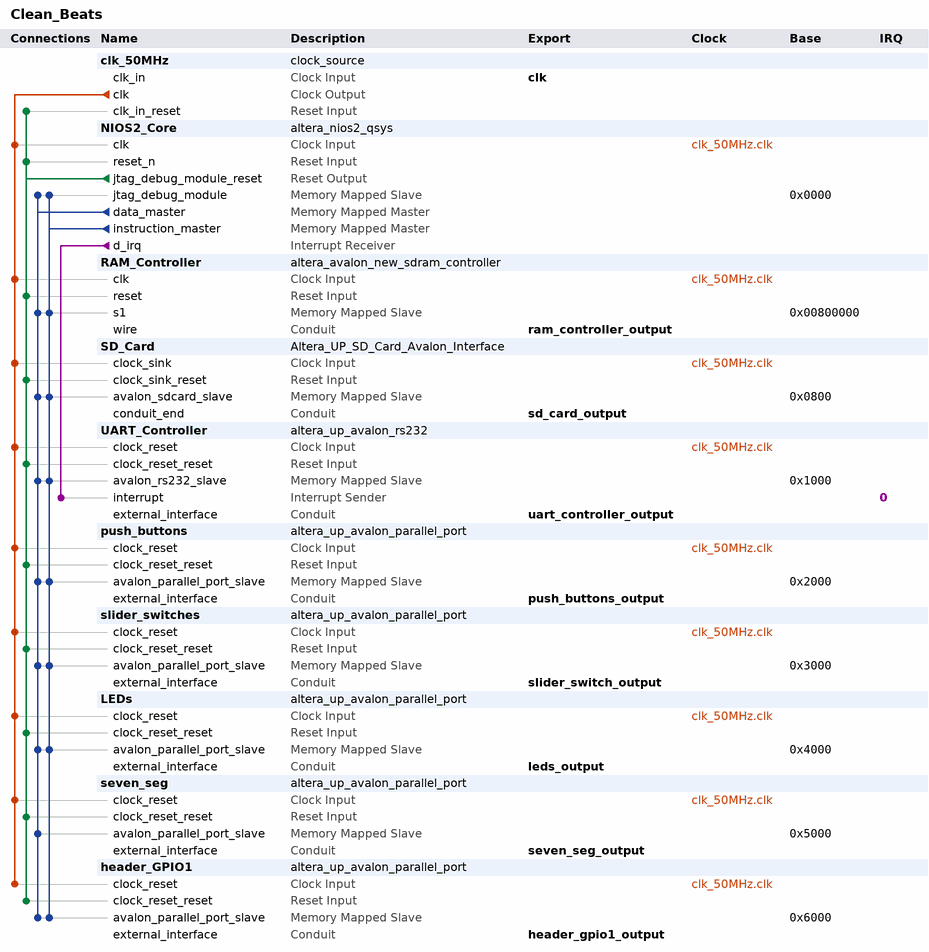
[diagram p0: system contents]
# Platform Designer (Qsys) system Clean_Beats, Cyclone III EP3C16F484C6
# Parameters at their usual value, and those the tool derives, are not listed.
package require -exact qsys 12.0
create_system Clean_Beats
set_project_property DEVICE_FAMILY {Cyclone III}
set_project_property DEVICE EP3C16F484C6

add_instance clk_50MHz clock_source 12.1
set_instance_parameter_value clk_50MHz clockFrequency 50000000

add_instance NIOS2_Core altera_nios2_qsys 12.1
set_instance_parameter_value NIOS2_Core resetSlave RAM_Controller.s1
set_instance_parameter_value NIOS2_Core exceptionSlave RAM_Controller.s1
set_instance_parameter_value NIOS2_Core breakSlave NIOS2_Core.jtag_debug_module
set_instance_parameter_value NIOS2_Core impl Fast
set_instance_parameter_value NIOS2_Core icache_size 4096
set_instance_parameter_value NIOS2_Core debug_level Level2

add_instance RAM_Controller altera_avalon_new_sdram_controller 12.1
set_instance_parameter_value RAM_Controller TAC 5.5
set_instance_parameter_value RAM_Controller TRCD 20.0
set_instance_parameter_value RAM_Controller TRP 20.0
set_instance_parameter_value RAM_Controller casLatency 3
set_instance_parameter_value RAM_Controller columnWidth 8
set_instance_parameter_value RAM_Controller dataWidth 16
set_instance_parameter_value RAM_Controller generateSimulationModel false
set_instance_parameter_value RAM_Controller model custom
set_instance_parameter_value RAM_Controller numberOfBanks 4
set_instance_parameter_value RAM_Controller numberOfChipSelects 1
set_instance_parameter_value RAM_Controller powerUpDelay 100.0
set_instance_parameter_value RAM_Controller refreshPeriod 15.625
set_instance_parameter_value RAM_Controller rowWidth 12

add_instance SD_Card Altera_UP_SD_Card_Avalon_Interface 1.0

add_instance UART_Controller altera_up_avalon_rs232 12.0
set_instance_parameter_value UART_Controller baud 115200
set_instance_parameter_value UART_Controller parity None

add_instance push_buttons altera_up_avalon_parallel_port 12.0
set_instance_parameter_value push_buttons board DE0
set_instance_parameter_value push_buttons preset Pushbuttons
set_instance_parameter_value push_buttons capture false
set_instance_parameter_value push_buttons edge Rising
set_instance_parameter_value push_buttons irq false

add_instance slider_switches altera_up_avalon_parallel_port 12.0
set_instance_parameter_value slider_switches board DE0
set_instance_parameter_value slider_switches preset {Slider Switches}
set_instance_parameter_value slider_switches capture false
set_instance_parameter_value slider_switches edge Rising
set_instance_parameter_value slider_switches irq false

add_instance LEDs altera_up_avalon_parallel_port 12.0
set_instance_parameter_value LEDs board DE0
set_instance_parameter_value LEDs preset LEDs
set_instance_parameter_value LEDs capture false
set_instance_parameter_value LEDs edge Rising
set_instance_parameter_value LEDs irq false

add_instance seven_seg altera_up_avalon_parallel_port 12.0
set_instance_parameter_value seven_seg board DE0
set_instance_parameter_value seven_seg preset {Seven Segment Displays}
set_instance_parameter_value seven_seg capture false
set_instance_parameter_value seven_seg edge Rising
set_instance_parameter_value seven_seg irq false

add_instance header_GPIO1 altera_up_avalon_parallel_port 12.0
set_instance_parameter_value header_GPIO1 board DE0
set_instance_parameter_value header_GPIO1 preset {Expansion Header}
set_instance_parameter_value header_GPIO1 gpio {GPIO 1 (JP2)}
set_instance_parameter_value header_GPIO1 capture false
set_instance_parameter_value header_GPIO1 edge Rising
set_instance_parameter_value header_GPIO1 irq false

# connections
add_connection clk_50MHz.clk header_GPIO1.clock_reset clock
add_connection clk_50MHz.clk LEDs.clock_reset clock
add_connection clk_50MHz.clk NIOS2_Core.clk clock
add_connection clk_50MHz.clk push_buttons.clock_reset clock
add_connection clk_50MHz.clk RAM_Controller.clk clock
add_connection clk_50MHz.clk SD_Card.clock_sink clock
add_connection clk_50MHz.clk seven_seg.clock_reset clock
add_connection clk_50MHz.clk slider_switches.clock_reset clock
add_connection clk_50MHz.clk UART_Controller.clock_reset clock
add_connection NIOS2_Core.jtag_debug_module_reset clk_50MHz.clk_in_reset reset
add_connection NIOS2_Core.jtag_debug_module_reset header_GPIO1.clock_reset_reset reset
add_connection NIOS2_Core.jtag_debug_module_reset LEDs.clock_reset_reset reset
add_connection NIOS2_Core.jtag_debug_module_reset NIOS2_Core.reset_n reset
add_connection NIOS2_Core.jtag_debug_module_reset push_buttons.clock_reset_reset reset
add_connection NIOS2_Core.jtag_debug_module_reset RAM_Controller.reset reset
add_connection NIOS2_Core.jtag_debug_module_reset SD_Card.clock_sink_reset reset
add_connection NIOS2_Core.jtag_debug_module_reset seven_seg.clock_reset_reset reset
add_connection NIOS2_Core.jtag_debug_module_reset slider_switches.clock_reset_reset reset
add_connection NIOS2_Core.jtag_debug_module_reset UART_Controller.clock_reset_reset reset
add_connection NIOS2_Core.data_master header_GPIO1.avalon_parallel_port_slave avalon
set_connection_parameter_value NIOS2_Core.data_master/header_GPIO1.avalon_parallel_port_slave baseAddress 0x6000
add_connection NIOS2_Core.data_master LEDs.avalon_parallel_port_slave avalon
set_connection_parameter_value NIOS2_Core.data_master/LEDs.avalon_parallel_port_slave baseAddress 0x4000
add_connection NIOS2_Core.data_master NIOS2_Core.jtag_debug_module avalon
set_connection_parameter_value NIOS2_Core.data_master/NIOS2_Core.jtag_debug_module baseAddress 0x0000
add_connection NIOS2_Core.data_master push_buttons.avalon_parallel_port_slave avalon
set_connection_parameter_value NIOS2_Core.data_master/push_buttons.avalon_parallel_port_slave baseAddress 0x2000
add_connection NIOS2_Core.data_master RAM_Controller.s1 avalon
set_connection_parameter_value NIOS2_Core.data_master/RAM_Controller.s1 baseAddress 0x00800000
add_connection NIOS2_Core.data_master SD_Card.avalon_sdcard_slave avalon
set_connection_parameter_value NIOS2_Core.data_master/SD_Card.avalon_sdcard_slave baseAddress 0x0800
add_connection NIOS2_Core.data_master seven_seg.avalon_parallel_port_slave avalon
set_connection_parameter_value NIOS2_Core.data_master/seven_seg.avalon_parallel_port_slave baseAddress 0x5000
add_connection NIOS2_Core.data_master slider_switches.avalon_parallel_port_slave avalon
set_connection_parameter_value NIOS2_Core.data_master/slider_switches.avalon_parallel_port_slave baseAddress 0x3000
add_connection NIOS2_Core.data_master UART_Controller.avalon_rs232_slave avalon
set_connection_parameter_value NIOS2_Core.data_master/UART_Controller.avalon_rs232_slave baseAddress 0x1000
add_connection NIOS2_Core.instruction_master header_GPIO1.avalon_parallel_port_slave avalon
set_connection_parameter_value NIOS2_Core.instruction_master/header_GPIO1.avalon_parallel_port_slave baseAddress 0x6000
add_connection NIOS2_Core.instruction_master LEDs.avalon_parallel_port_slave avalon
set_connection_parameter_value NIOS2_Core.instruction_master/LEDs.avalon_parallel_port_slave baseAddress 0x4000
add_connection NIOS2_Core.instruction_master NIOS2_Core.jtag_debug_module avalon
set_connection_parameter_value NIOS2_Core.instruction_master/NIOS2_Core.jtag_debug_module baseAddress 0x0000
add_connection NIOS2_Core.instruction_master push_buttons.avalon_parallel_port_slave avalon
set_connection_parameter_value NIOS2_Core.instruction_master/push_buttons.avalon_parallel_port_slave baseAddress 0x2000
add_connection NIOS2_Core.instruction_master RAM_Controller.s1 avalon
set_connection_parameter_value NIOS2_Core.instruction_master/RAM_Controller.s1 baseAddress 0x00800000
add_connection NIOS2_Core.instruction_master SD_Card.avalon_sdcard_slave avalon
set_connection_parameter_value NIOS2_Core.instruction_master/SD_Card.avalon_sdcard_slave baseAddress 0x0800
add_connection NIOS2_Core.instruction_master slider_switches.avalon_parallel_port_slave avalon
set_connection_parameter_value NIOS2_Core.instruction_master/slider_switches.avalon_parallel_port_slave baseAddress 0x3000
add_connection NIOS2_Core.instruction_master UART_Controller.avalon_rs232_slave avalon
set_connection_parameter_value NIOS2_Core.instruction_master/UART_Controller.avalon_rs232_slave baseAddress 0x1000
add_connection NIOS2_Core.d_irq UART_Controller.interrupt interrupt
set_connection_parameter_value NIOS2_Core.d_irq/UART_Controller.interrupt irqNumber 0

# exported interfaces
add_interface clk clock sink
set_interface_property clk EXPORT_OF clk_50MHz.clk_in
add_interface ram_controller_output conduit end
set_interface_property ram_controller_output EXPORT_OF RAM_Controller.wire
add_interface sd_card_output conduit end
set_interface_property sd_card_output EXPORT_OF SD_Card.conduit_end
add_interface uart_controller_output conduit end
set_interface_property uart_controller_output EXPORT_OF UART_Controller.external_interface
add_interface push_buttons_output conduit end
set_interface_property push_buttons_output EXPORT_OF push_buttons.external_interface
add_interface slider_switch_output conduit end
set_interface_property slider_switch_output EXPORT_OF slider_switches.external_interface
add_interface leds_output conduit end
set_interface_property leds_output EXPORT_OF LEDs.external_interface
add_interface seven_seg_output conduit end
set_interface_property seven_seg_output EXPORT_OF seven_seg.external_interface
add_interface header_gpio1_output conduit end
set_interface_property header_gpio1_output EXPORT_OF header_GPIO1.external_interface

save_system Clean_Beats.qsys
